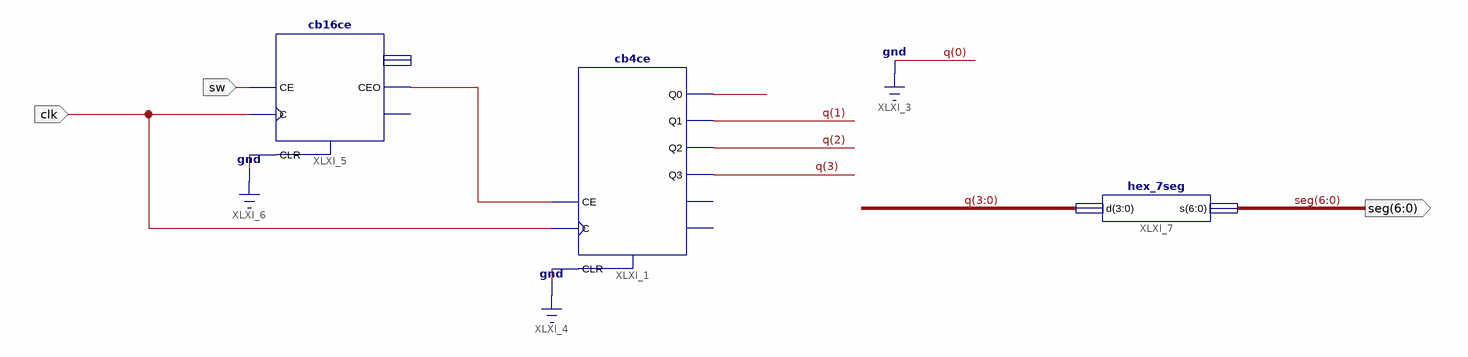
[diagram p0: schematic sheet 1]
// Xilinx ISE schematic szamlalo3_remake.sch (spartan3e) as structural Verilog: 3 symbols, 3 ports
module szamlalo3_remake (
  input  sw,
  input  clk,
  output [6:0] seg
);

  wire XLXN_1, XLXN_10;
  wire [3:1] q;

  cb4ce XLXI_1 (.C(clk), .CE(XLXN_10), .CLR(1'b0), .Q0(XLXN_1), .Q1(q[1]), .Q2(q[2]), .Q3(q[3]));  // open: CEO, TC
  cb16ce XLXI_5 (.C(clk), .CE(sw), .CLR(1'b0), .CEO(XLXN_10));  // open: Q, TC
  hex_7seg XLXI_7 (.d({q, 1'b0}), .s(seg));
endmodule
